# Altium schematic sheet Main Connectors.SchDoc
size A4; SheetNumber: 2; SheetTotal: 4
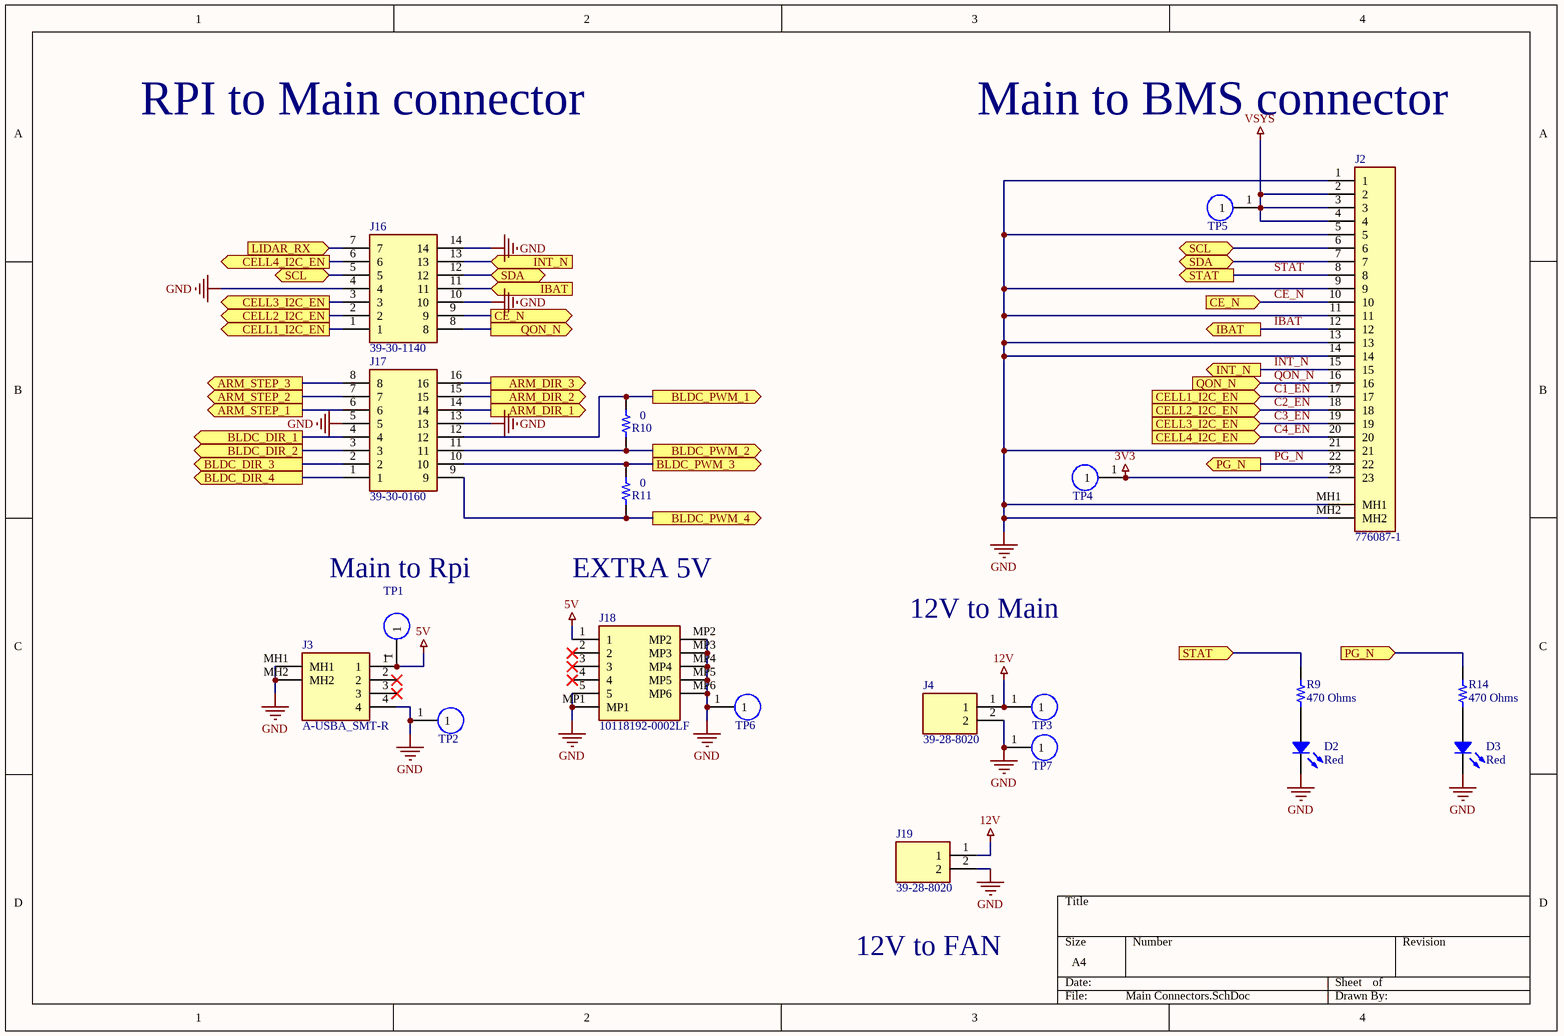
[diagram p0: Main Connectors.SchDoc]

## Parts
D2  Red  [LED 0805_2012 RED]
D3  Red  [LED 0805_2012 RED]
J2  776087-1  [7760871]
J3  A-USBA_SMT-R  [AUSBASMTR]
J4  39-28-8020  [SHDR2W125P550X420_2X1_540X960X1310P]
J16  39-30-1140  [39301142]
J17  39-30-0160  [39301160]
J18  10118192-0002LF  [101181920002LF]
J19  39-28-8020  [SHDR2W125P550X420_2X1_540X960X1310P]
R9  470 Ohms  [RES 0603_1608]
R10  0  [RES 0603_1608]
R11  0  [RES 0603_1608]
R14  470 Ohms  [RES 0603_1608]
TP1  380-10-101-00-002000  [HDRV1W51P0X254_1X1_254X254X470P]  (value not drawn)
TP2  380-10-101-00-002000  [HDRV1W51P0X254_1X1_254X254X470P]  (value not drawn)
TP3  380-10-101-00-002000  [HDRV1W51P0X254_1X1_254X254X470P]  (value not drawn)
TP4  380-10-101-00-002000  [HDRV1W51P0X254_1X1_254X254X470P]  (value not drawn)
TP5  380-10-101-00-002000  [HDRV1W51P0X254_1X1_254X254X470P]  (value not drawn)
TP6  380-10-101-00-002000  [HDRV1W51P0X254_1X1_254X254X470P]  (value not drawn)
TP7  380-10-101-00-002000  [HDRV1W51P0X254_1X1_254X254X470P]  (value not drawn)

## Ports
ARM_DIR_1 (out), ARM_DIR_2 (out), ARM_DIR_3 (out), ARM_STEP_1 (out), ARM_STEP_2 (out), ARM_STEP_3 (out), BLDC_DIR_1 (out), BLDC_DIR_2 (out), BLDC_DIR_3 (out), BLDC_DIR_4 (out), BLDC_PWM_1 (out), BLDC_PWM_2 (out), BLDC_PWM_3 (out), BLDC_PWM_4 (out), CE_N (in), CE_N (out), CELL1_I2C_EN (in), CELL1_I2C_EN (out), CELL2_I2C_EN (in), CELL2_I2C_EN (out), CELL3_I2C_EN (in), CELL3_I2C_EN (out), CELL4_I2C_EN (in), CELL4_I2C_EN (out), IBAT (in), IBAT (out), INT_N (in), INT_N (out), LIDAR_RX (in), PG_N (in), PG_N (out), QON_N (in), QON_N (out), SCL (bidir), SDA (bidir), STAT (in), STAT (out)

## Nets
3V3: J2.23 TP4.1
5V: J3.1 J18.1 TP1.1
12V: J4.1 J19.1 TP3.1
GND: D2.2 D3.2 J2.1 J2.5 J2.9 J2.11 J2.13 J2.14 J2.21 J2.MH1 J2.MH2 J3.4 J3.MH1 J3.MH2 J4.2 J16.4 J16.10 J16.14 J17.5 J17.13 J18.5 J18.MP1 J18.MP2 J18.MP3 J18.MP4 J18.MP5 J18.MP6 J19.2 TP2.1 TP6.1 TP7.1
VSYS: J2.2 J2.3 J2.4 TP5.1
ARM_DIR_1: J17.14 ; port ARM_DIR_1
ARM_DIR_2: J17.15 ; port ARM_DIR_2
ARM_DIR_3: J17.16 ; port ARM_DIR_3
ARM_STEP_1: J17.6 ; port ARM_STEP_1
ARM_STEP_2: J17.7 ; port ARM_STEP_2
ARM_STEP_3: J17.8 ; port ARM_STEP_3
BLDC_DIR_1: J17.4 ; port BLDC_DIR_1
BLDC_DIR_2: J17.3 ; port BLDC_DIR_2
BLDC_DIR_3: J17.2 ; port BLDC_DIR_3
BLDC_DIR_4: J17.1 ; port BLDC_DIR_4
BLDC_PWM_1: J17.12 R10.2 ; port BLDC_PWM_1
BLDC_PWM_2: J17.11 R10.1 ; port BLDC_PWM_2
BLDC_PWM_3: J17.10 R11.2 ; port BLDC_PWM_3
BLDC_PWM_4: J17.9 R11.1 ; port BLDC_PWM_4
C1_EN: J2.17 J16.1 ; port CELL1_I2C_EN
C2_EN: J2.18 J16.2 ; port CELL2_I2C_EN
C3_EN: J2.19 J16.3 ; port CELL3_I2C_EN
C4_EN: J2.20 J16.6 ; port CELL4_I2C_EN
CE_N: J2.10 J16.9 ; port CE_N
IBAT: J2.12 J16.11 ; port IBAT
INT_N: J2.15 J16.13 ; port INT_N
LIDAR_RX: J16.7 ; port LIDAR_RX
PG_N: J2.22 R14.2 ; port PG_N
QON_N: J2.16 J16.8 ; port QON_N
SCL: J2.6 J16.5 ; port SCL
SDA: J2.7 J16.12 ; port SDA
STAT: J2.8 R9.2 ; port STAT
NetD2_1: D2.1 R9.1
NetD3_1: D3.1 R14.1

Not connected (* = marked no-connect by the designer): J3 2* 3*; J18 2* 3* 4*

## Notes on the sheet
- RPI to Main connector
- Main to BMS connector
- Main to Rpi
- EXTRA 5V
- 12V to Main
- 12V to FAN

## Library data of the parts
D2 D3 = CMD17-21VRD/TR8: LED RED DIFFUSED 0805 SMD; Manufacturer: Visual Communications Company - VCC; Configuration: Standard; Current - Test: 20mA; Lens Size: 1.40mm x 1.25mm; Lens Style: Rectangle with Flat Top; Millicandela Rating: 6mcd; Viewing Angle: 140°; Voltage - Forward (Vf) (Typ): 2V; Wavelength - Peak: 640nm; Part Number: CMD17-21VRD/TR8; Color: Red; ComponentLink1Description: Datasheet; ComponentLink1URL: https://vcclite.com/wp-content/uploads/wpallimport/files/files/CMD1721Seriesver3.pdf; ComponentLink2Description: DigiKey Link; ComponentLink2URL: http://digikey.com/product-detail/en/visual-communications-company-vcc/CMD17-21VRD-TR8/L62501CT-ND/254934; Device Package: 0805 (2012 Metric); Height (Max): 1.20mm; LastUpdated: 2020-09-02 1:21:00 AM; Lens Color: Red; Lens Transparency: Diffused; Lifecycle Status: Active; Minimum Order: 1; Mounting Type: Surface Mount; Package / Case: 0805 (2012 Metric); Packaging: TapeAndReel; PartId: 366; Part Status: Active; Price: 0.12; Series: CMD17-21; Size / Dimension: 2.00mm L x 1.25mm W; Supplier 1: DigiKey; Supplier Part Number 1: L62501CT-ND; Supplier Device Package: 0805; Value: Red
J2 = 776087-1: Connector; Manufacturer_Name: TE Connectivity; Datasheet Link: https://componentsearchengine.com/Datasheets/1/776087-1.pdf; Height: 32.1mm; Manufacturer_Part_Number: 776087-1; Mouser Part Number: 571-776087-1; Mouser Price/Stock: https://www.mouser.co.uk/ProductDetail/TE-Connectivity/776087-1?qs=qXO2HHLAcoIjggUTPuCD9w%3D%3D; Arrow Part Number: 776087-1; Arrow Price/Stock: https://www.arrow.com/en/products/776087-1/te-connectivity?region=europe
J3 = A-USBA_SMT-R: Connector; Manufacturer_Name: ASSMANN WSW components GmbH; Manufacturer_Part_Number: A-USBA/SMT-R; Height: 7.12mm
J4 J19 = 39-28-8020: Connector; Manufacturer_Name: Molex; Datasheet Link: http://www.molex.com/molex/products/datasheet.jsp?part=active/0039288020_PCB_HEADERS.xml; Height: 13.1mm; Manufacturer_Part_Number: 39-28-8020; Mouser Part Number: 538-39-28-8020; Mouser Price/Stock: https://www.mouser.co.uk/ProductDetail/Molex/39-28-8020?qs=ZZBj1wiNDbnzWLcHr%2Fqwqw%3D%3D
J16 = 39-30-1140: Connector; Manufacturer_Name: Molex; Datasheet Link: https://www.molex.com/pdm_docs/sd/039301140_sd.pdf; Height: 11.25mm; Manufacturer_Part_Number: 39-30-1140; Mouser Part Number: 538-39-30-1140; Mouser Price/Stock: https://www.mouser.co.uk/ProductDetail/Molex/39-30-1140?qs=ZZBj1wiNDbmCkxw7hxL8nQ%3D%3D
J17 = 39-30-0160: Connector; Manufacturer_Name: Molex; Datasheet Link: https://www.molex.com/pdm_docs/sd/039300160_sd.pdf; Height: 9mm; Manufacturer_Part_Number: 39-30-0160; Mouser Part Number: 538-39-30-0160; Mouser Price/Stock: https://www.mouser.co.uk/ProductDetail/Molex/39-30-0160?qs=KHty%2FoMxDPnJHzmu54XA5A%3D%3D
J18 = 10118192-0002LF: Connector; Manufacturer_Name: Amphenol; Datasheet Link: https://componentsearchengine.com/Datasheets/1/10118192-0002LF.pdf; Height: 3.05mm; Manufacturer_Part_Number: 10118192-0002LF; Mouser Part Number: 649-10118192-0002LF; Mouser Price/Stock: https://www.mouser.co.uk/ProductDetail/Amphenol-FCI/10118192-0002LF?qs=KVgMXE4aH4nIkuWlMxQzog%3D%3D; Arrow Part Number: 10118192-0002LF; Arrow Price/Stock: https://www.arrow.com/en/products/10118192-0002lf/amphenol-fci?region=nac
R9 R14 = ERJ-3EKF4700V: RES SMD 470 OHM 1% 1/10W 0603; Manufacturer: Panasonic Electronic Components; Power (Watts): 0.1W, 1/10W; Temperature Coefficient: ±100ppm/°C; Part Number: ERJ-3EKF4700V; Value: 470 Ohms; ComponentLink1Description: Datasheet; ComponentLink1URL: https://industrial.panasonic.com/cdbs/www-data/pdf/RDA0000/AOA0000C304.pdf; ComponentLink2Description: DigiKey Link; ComponentLink2URL: http://digikey.com/product-detail/en/panasonic-electronic-components/ERJ-3EKF4700V/P470HCT-ND/1746781; Composition: Thick Film; Device Package: 0603 (1608 Metric); Features: Automotive AEC-Q200; Height - Seated (Max): 0.022" (0.55mm); LastUpdated: 2020-09-02 1:10:23 AM; Lifecycle Status: Active; Minimum Order: 1; Number of Terminations: 2; Operating Temperature: -55°C ~ 155°C; Package / Case: 0603 (1608 Metric); Packaging: TapeAndReel; PartId: 5664; Part Status: Active; Price: 0.01; Ratings: AEC-Q200; Resistance: 470 Ohms; Series: ERJ; Size / Dimension: 0.063" L x 0.031" W (1.60mm x 0.80mm); Supplier 1: DigiKey; Supplier Part Number 1: P470HCT-ND; Supplier Device Package: 0603; Tolerance: ±1%
R10 R11 = TLRZ1JTTD: RES 0 OHM JUMPER 0603; Manufacturer: KOA Speer Electronics, Inc.; Part Number: TLRZ1JTTD; ComponentLink1Description: Datasheet; ComponentLink1URL: http://www.koaspeer.com/catimages/Products/TLRZ/TLRZ.pdf; ComponentLink2Description: DigiKey Link; ComponentLink2URL: http://digikey.com/product-detail/en/koa-speer-electronics-inc/TLRZ1JTTD/2019-TLRZ1JTTDCT-ND/9847537; Composition: Metal Element; Device Package: 0603 (1608 Metric); Features: Automotive AEC-Q200, Current Sense; Height - Seated (Max): 0.022" (0.55mm); LastUpdated: 2020-09-02 1:10:25 AM; Lifecycle Status: Active; Minimum Order: 1; Number of Terminations: 2; Operating Temperature: -55°C ~ 170°C; Package / Case: 0603 (1608 Metric); Packaging: TapeAndReel; PartId: 4851; Part Status: Active; Price: 0.08; Ratings: AEC-Q200; Series: TLRZ; Size / Dimension: 0.063" L x 0.031" W (1.60mm x 0.80mm); Supplier 1: DigiKey; Supplier Part Number 1: 2019-TLRZ1JTTDCT-ND; Supplier Device Package: 0603; Tolerance: Jumper
TP1-TP7 = 380-10-101-00-002000: Connector; Manufacturer_Name: Mill-Max; Datasheet Link: https://datasheet.datasheetarchive.com/originals/distributors/DKDS-31/604668.pdf; Height: 4.7mm; Manufacturer_Part_Number: 380-10-101-00-002000; Mouser Part Number: 575-3801010100002000; Mouser Price/Stock: https://www.mouser.com/Search/Refine.aspx?Keyword=575-3801010100002000; Arrow Part Number: 380-10-101-00-002000; Arrow Price/Stock: https://www.arrow.com/en/products/380-10-101-00-002000/mill-max